# EAGLE design CMP (EAGLE 9.6.2)
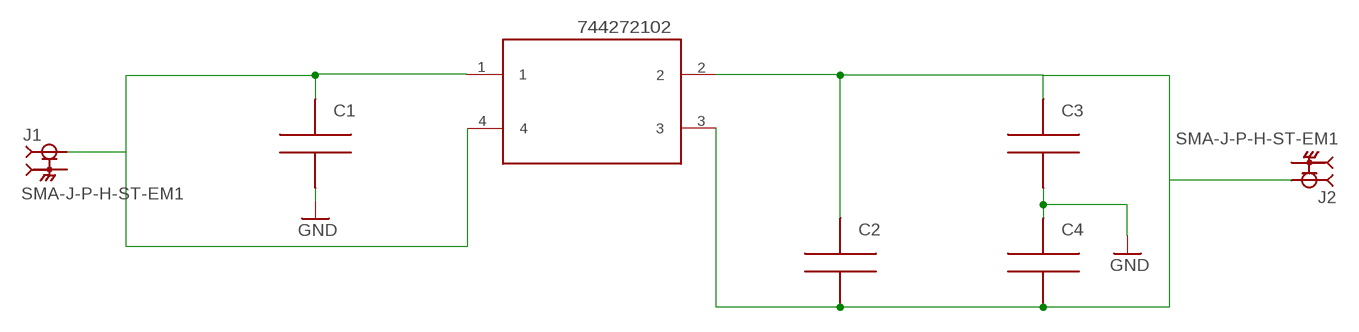
[diagram p0: schematic, sheet 1]

## Parts
C1  CAPA1206  [FGJGFN]
C2  CAPA1206  [FGJGFN]
C3  CAPA1206  [FGJGFN]
C4  CAPA1206  [FGJGFN]
CHIP  CHOKE  [CHOKE]
J1  SMA-J-P-H-ST-EM1  [SAMTEC_SMA-J-P-H-ST-EM1]
J2  SMA-J-P-H-ST-EM1  [SAMTEC_SMA-J-P-H-ST-EM1]

## Nets
GND: C1.1 C3.1 C4.2
N$1: C2.1 C2.2 C3.2 C4.1 CHIP.2 CHIP.3 J2.1
N$3: C1.2 CHIP.1 CHIP.4 J1.1
Unconnected: J1.2_1 J1.2_2 J1.3_1 J1.3_2 J2.2_1 J2.2_2 J2.3_1 J2.3_2

## Notes on the sheet
- C1=1500pF

## Library data of the parts
C1-C4 = capa:CAPA
CHIP = CHOKE:CHOKE
J1 J2 = SMA:SMA-J-P-H-ST-EM1: SMA Connector Jack, Female Socket 50Ohm Board Edge, End Launch Solder; MANUFACTURER: Samtec; MAXIMUM_PACKAGE_HEIGHT: 3.675mm; PARTREV: G; STANDARD: Manufacturer Recommendations

## Board
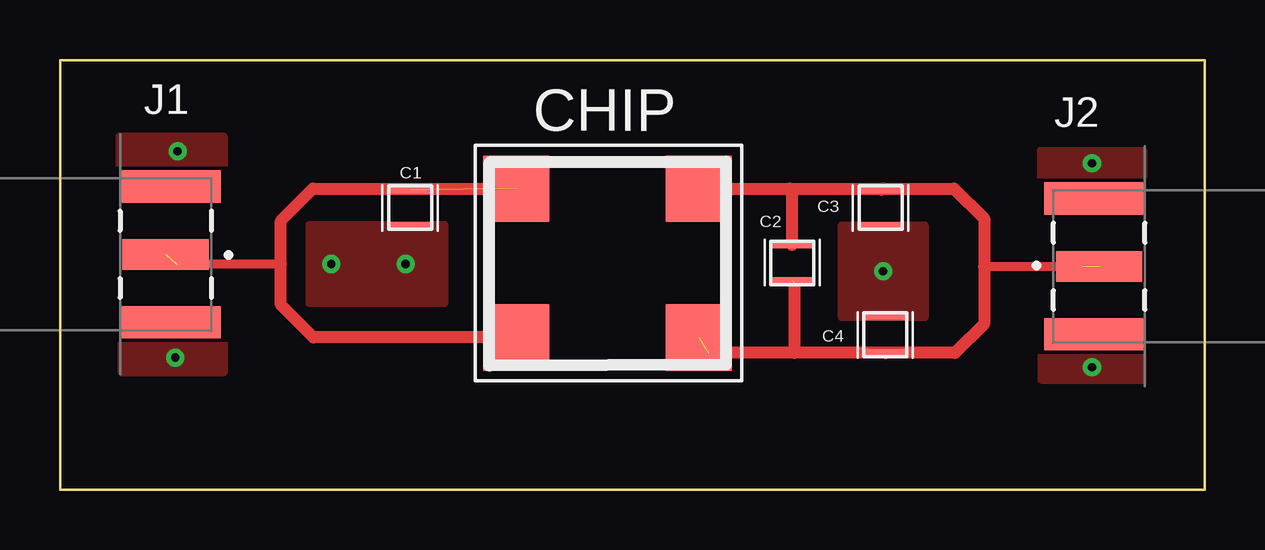
[diagram p1: board, top side]
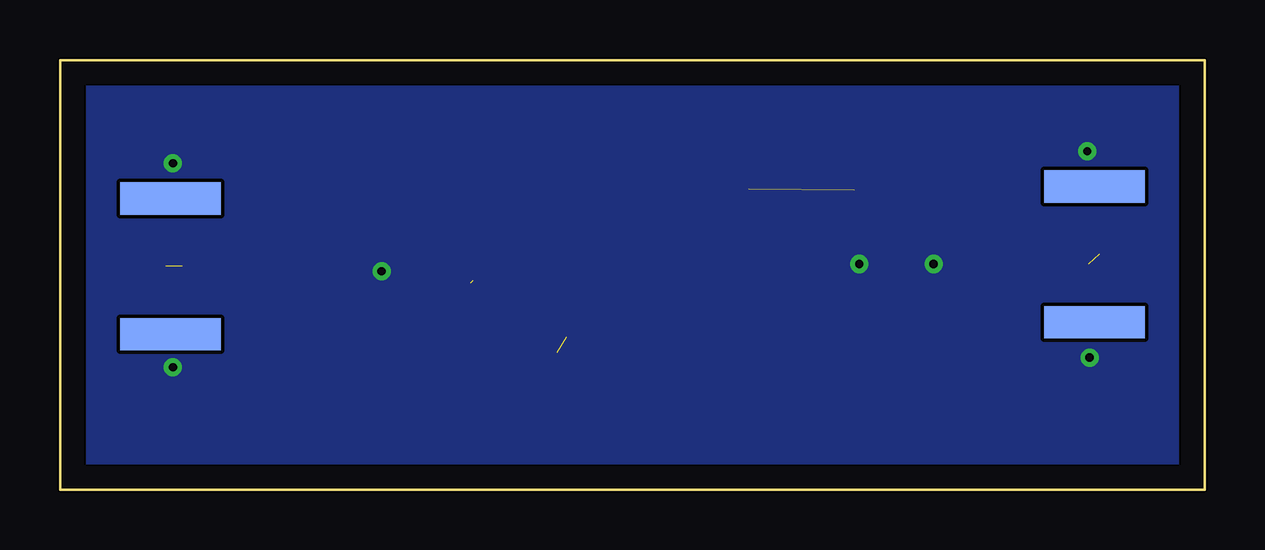
[diagram p2: board, bottom side, seen from below]

Size 47.7 x 17.9 mm. Coordinates in mm from the lower left corner, seen from the top.
Outline: 0,17.9 47.7,17.9 47.7,0 0,0 0,17.9
Copper layers (1*16): Top 0.035mm / dielectric 1.5mm / Bottom 0.035mm
Design rules "default": minimum track width 6mil, minimum drill 0.35mm, track to track 6mil, track to pad 6mil, pad to pad 6mil, via to via 6mil, smd to smd 6mil, copper to edge 40mil, drill to drill 6mil, minimum pad ring 10mil, minimum via ring 8mil, stop-mask expansion 4mil, vias tented up to drill 0mil, thermal gap 10mil

### Footprints (pad centres in the part's own frame; a part is rotated, then mirrored left to right if it is on the bottom)
FGJGFN = smd 0.3 x 1.8: 1 -0.8,0; 2 0.7,0
CHOKE = smd 2.76 x 2.76: 1 -3.79,2.54; 2 3.81,2.54; 3 3.81,-3.66; 4 -3.79,-3.66
SAMTEC_SMA-J-P-H-ST-EM1 = smd 1.27 x 3.6: 1 0,0 | smd 1.35 x 4.2: 2_1 -2.825,0.2; 3_1 2.825,0.2 | smd 1.35 x 4.2 bottom: 2_2 -2.825,0.2; 3_2 2.825,0.2

### Placement (x,y rotation side)
C1  14.6,11.8 90 top
C2  30.5,9.4 270 top
C3  34.2,11.8 90 top
C4  34.4,6.5 90 top
CHIP  22.8,10 0 top
J1  4.4,9.8 270 top
J2  43.3,9.3 90 top

### Tracks (layer width: path | path; a pad name or v marks a point on that pad's centre or on a via)
GND  (via drill 0.35)
  Top 0.2: 14.4,11 C1.1
  other vias: 11.3,9.4 14.4,9.4 34.3,9.1 4.9,14.1 4.8,5.5 43,5.1 43,13.6
  pour Top (no thermals): 32.6,11 36,11 36,7.2 32.6,7.2
  pour Top (no thermals): 16,11 10.4,11 10.4,7.8 16,7.8
  pour Top: 2.5,14.7 6.8,14.7 6.8,11.9 2.5,11.9
  pour Top: 2.6,7.7 6.8,7.7 6.8,4.9 2.6,4.9
  pour Top: 45.1,11.3 40.9,11.3 40.9,14.1 45.1,14.1
  pour Top: 45.1,7.5 40.9,7.5 40.9,4.6 45.1,4.6
  pour Bottom: 0,17.9 47.7,17.9 47.7,0 0,0
N$1  (3 unrouted)
  Top 0.38: 38.5,9.3 42.6,9.3
  Top 0.5: CHIP.2 30.4,12.54 | 30.4,12.54 34.3,12.54 | 34.3,12.54 37.26,12.54 38.5,11.3 38.5,9.3 38.5,6.9 37.3,5.7 C4.1 30.6,5.7 | 30.6,5.7 27,5.7 | 30.6,8.6 30.6,5.7 | C2.1 30.5,12.44 30.4,12.54 | C3.2 34.26,12.5 34.3,12.54
N$3  (2 unrouted)
  Top 0.38: 9.2,9.4 4.86,9.4
  Top 0.5: CHIP.4 10.56,6.34 9.2,7.7 9.2,9.4 9.2,11.2 10.54,12.54 CHIP.1